# Altium project AAS_touch_board_rev1_1.PrjPcb
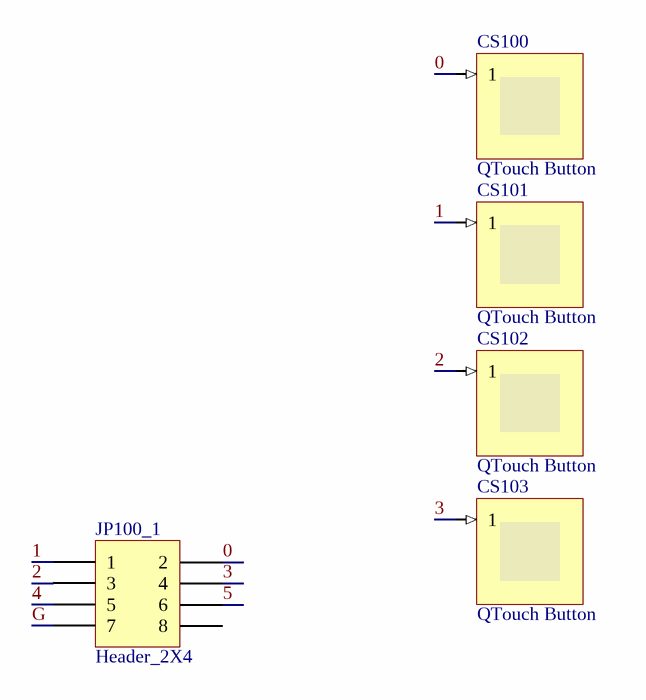
[diagram p0: AAS_touch_board_rev1_1.SchDoc]
ProjecTevisionDate: 14; ProjectNameText: AAS touch board; ProjectRevision: 1.1
1 sheet, 5 parts. Net scope: hierarchical (ports join the sheet entries above them; power ports are global).
Board files: AAS_touch_board_rev1_1.PcbDoc, AAS_touch_board_rev1_1_PANEL.PcbDoc

## Sheet AAS_touch_board_rev1_1.SchDoc: AAS touch board
size A4; Author: Richard Kubíček; DocumentNumber: 1; SheetNumber: 1; SheetTotal: 1; PageSize: A4; DruhPraceRadek1: Diplomová; DruhPraceRadek2: práce

### Parts
CS100  QTouch Button  (no BOM)
CS101  QTouch Button  (no BOM)
CS102  QTouch Button  (no BOM)
CS103  QTouch Button  (no BOM)
JP100_1  Header_2X4  [HDR2X4]

### Nets
0: CS100.1 JP100_1.2
1: CS101.1 JP100_1.1
2: CS102.1 JP100_1.3
3: CS103.1 JP100_1.4
4: JP100_1.5
5: JP100_1.6
G: JP100_1.7

Not connected (* = marked no-connect by the designer): JP100_1 8

### Notes on the sheet
- Druh práce
- Název dokumentu
- Projekt
- Autor
- Revize
- Strana

### Library data of the parts
CS100-CS103 = QTouchButton: ConfiguratorName: ATMEL_TOUCH; ConfigurationParameters: {}__sensorid[1]{}width[9]{}height[8]{}
JP100_1 = 19: Header dual row; ID: 19; UR: 0,1; ABRA number: 120430; Value: Header_2X4; Technology: THT